# Altium schematic sheet Connectors.SchDoc
size Legal; SheetNumber: 5; SheetTotal: 5
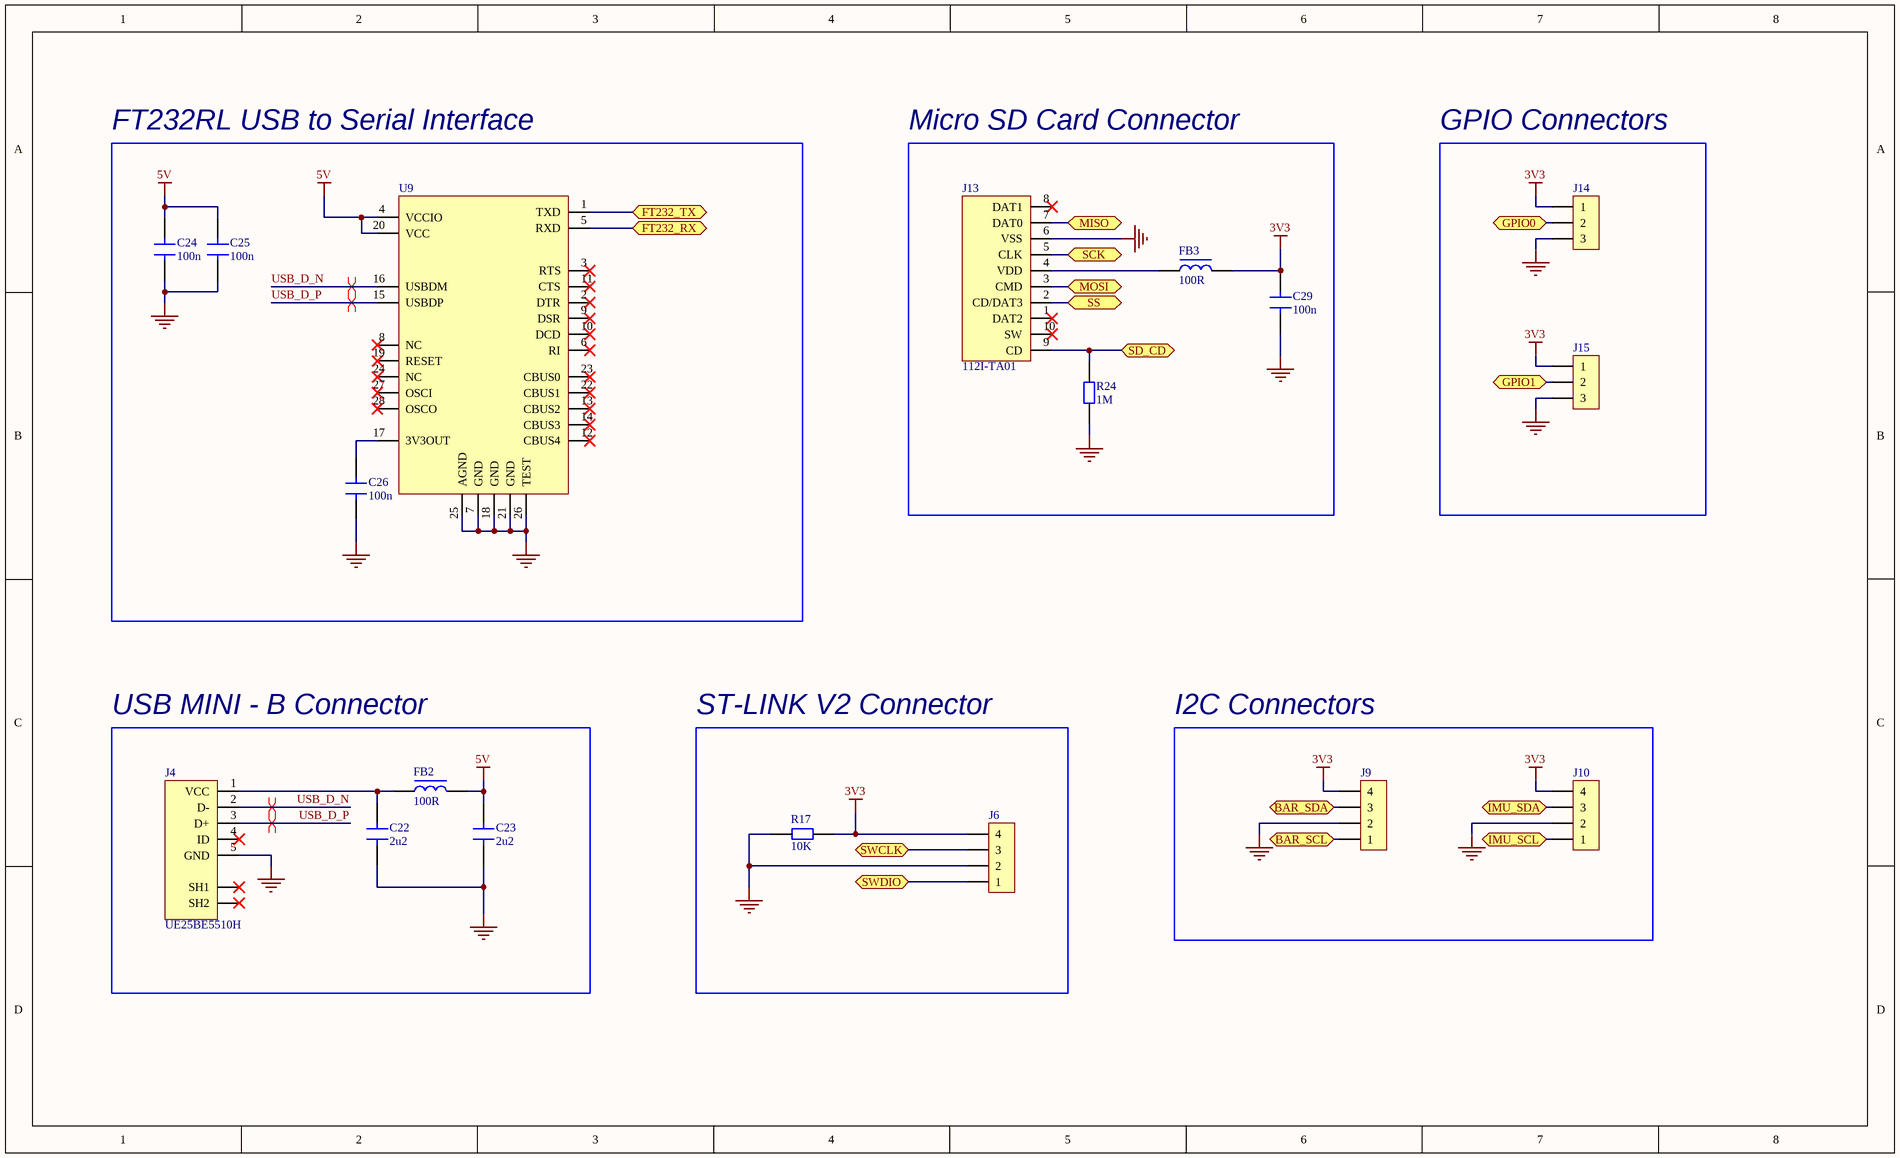
[diagram p0: Connectors.SchDoc]

## Parts
C22  2u2  [CAP 0805]
C23  2u2  [CAP 0805]
C24  100n  [CAP 0603]
C25  100n  [CAP 0603]
C26  100n  [CAP 0603]
C29  100n  [CAP 0603]
FB2  100R  [FB 0805]
FB3  100R  [FB 0603]
J4  UE25BE5510H  [UE25BE55H]
J6  1x4 HEADER MALE  [1X4 HEADER MALE]  (value not drawn)
J9  1x4 HEADER MALE  [1X4 HEADER MALE]  (value not drawn)
J10  1x4 HEADER MALE  [1X4 HEADER MALE]  (value not drawn)
J13  112I-TA01  [112I-TA01]
J14  JST B3B-XH-A  [JST_B3B-XH-A]  (value not drawn)
J15  JST B3B-XH-A  [JST_B3B-XH-A]  (value not drawn)
R17  10K  [RES 0603]
R24  1M  [RES 0603]
U9  FT232RL-REEL  [FT232RL]  (value not drawn)

## Blocks framed on the sheet
FT232RL USB to Serial Interface: C24-C26 U9
Micro SD Card Connector: C29 FB3 J13 R24
GPIO Connectors: J14 J15
USB MINI - B Connector: C22 C23 FB2 J4
ST-LINK V2 Connector: J6 R17
I2C Connectors: J9 J10

## Ports
BAR_SCL (bidir, see MCU[4C], Peripherals[3A]), BAR_SDA (bidir, see MCU[4C], Peripherals[3A]), FT232_RX (bidir, see MCU[4B]), FT232_TX (bidir, see MCU[4B]), GPIO0 (bidir, see MCU[4C]), GPIO1 (bidir, see MCU[4C]), IMU_SCL (bidir, see MCU[4B], Peripherals[5A]), IMU_SDA (bidir, see MCU[2C], Peripherals[5A]), MISO (bidir, see MCU[4B]), MOSI (bidir, see MCU[4B]), SCK (bidir, see MCU[4B]), SD_CD (bidir, see MCU[2C]), SS (bidir, see MCU[4B]), SWCLK (bidir, see MCU[4B]), SWDIO (bidir, see MCU[4B])

## Nets
3V3: C29.2 FB3.2 J6.4 J9.4 J10.4 J14.1 J15.1 R17.2
5V: C23.2 C24.2 C25.2 FB2.2 U9.4(VCCIO) U9.20(VCC)
GND: C22.1 C23.1 C24.1 C25.1 C26.1 C29.1 J4.5(GND) J6.2 J9.2 J10.2 J13.6(VSS) J14.3 J15.3 R17.1 R24.1 U9.7(GND) U9.18(GND) U9.21(GND) U9.25(AGND) U9.26(TEST)
BAR_SCL: J9.1 ; port BAR_SCL
BAR_SDA: J9.3 ; port BAR_SDA
FT232_RX: U9.5(RXD) ; port FT232_RX
FT232_TX: U9.1(TXD) ; port FT232_TX
GPIO0: J14.2 ; port GPIO0
GPIO1: J15.2 ; port GPIO1
IMU_SCL: J10.1 ; port IMU_SCL
IMU_SDA: J10.3 ; port IMU_SDA
MISO: J13.7(DAT0) ; port MISO
MOSI: J13.3(CMD) ; port MOSI
SCK: J13.5(CLK) ; port SCK
SD_CD: J13.9(CD) R24.2 ; port SD_CD
SS: J13.2(CD/DAT3) ; port SS
SWCLK: J6.3 ; port SWCLK
SWDIO: J6.1 ; port SWDIO
USB_D_N: J4.2(D-) U9.16(USBDM)
USB_D_P: J4.3(D+) U9.15(USBDP)
NetC22_2: C22.2 FB2.1 J4.1(VCC)
NetC26_2: C26.2 U9.17(3V3OUT)
NetFB3_1: FB3.1 J13.4(VDD)

Not connected (* = marked no-connect by the designer): J4 4(ID)* SH1* SH2*; J13 1(DAT2)* 8(DAT1)* 10(SW)*; U9 2(DTR)* 3(RTS)* 6(RI)* 8(NC)* 9(DSR)* 10(DCD)* 11(CTS)* 12(CBUS4)* 13(CBUS2)* 14(CBUS3)* 19(RESET)* 22(CBUS1)* 23(CBUS0)* 24(NC)* 27(OSCI)* 28(OSCO)*

## Layout directives
differential pair; differential pair class DIFF_USB: USB_D_N, USB_D_P

## Library data of the parts
C22 C23 = CAP 0805 25V: Capacitor SMD 0805 25V
C24-C26 C29 = CAP 0603 50V: Capacitor SMD 0603 50V
FB2 = FB 0805: Ferrite Bead SMD 0805
FB3 = FB 0603: Ferrite Bead SMD 0603
J4 = UE25BE5510H: Conn Mini USB 2.0 Type B RCP 5 POS 0.8mm Solder ST Thru-Hole 5 Terminal 1 Port; Manufacturer: Amphenol Commercial; Supplier 1: Arrow Electronics; Manufacturer Part Number: UE25BE5510H; RoHS: Yes; Category: USB Connectors; Stock 1: 16852; Pricing 1: 1=0,4693, 10=0,4507, 25=0,4468, 50=0,4303, 100=0,4157 (USD); ComponentLink1URL: http://www.alliedelec.com/m/d/e7e3d7a920045eebbdef787e60d8b001.pdf?src-supplier=Allied+Electronics; ComponentLink1Description: http://www.alliedelec.com/m/d/e7e3d7a920045eebbdef787e60d8b001.pdf?src-supplier=Allied+Electronics; ComponentLink2URL: https://www.amphenolcanada.com/ProductSearch/drawings/AC/UE25BEX510X.pdf?src-supplier=Digi-Key; ComponentLink2Description: https://www.amphenolcanada.com/ProductSearch/drawings/AC/UE25BEX510X.pdf?src-supplier=Digi-Key; ComponentLink3URL: https://datasheet.octopart.com/UE25-BE55-10H-Amphenol-datasheet-14681365.pdf?src-supplier=Future+Electronics; ComponentLink3Description: https://datasheet.octopart.com/UE25-BE55-10H-Amphenol-datasheet-14681365.pdf?src-supplier=Future+Electronics; ComponentLink4URL: https://datasheet.octopart.com/UE25BE5510H-Amphenol-Communications-Solutions-datasheet-62282189.pdf?src-supplier=Electro+Sonic; ComponentLink4Description: https://datasheet.octopart.com/UE25BE5510H-Amphenol-Communications-Solutions-datasheet-62282189.pdf?src-supplier=Electro+Sonic; Supplier Part Number 1: UE25BE5510H
J13 = 112I-TA01: Micro SD Card Push-Pull 10P (8+2), Switch, Peg, SMD 112I-TA01
J14 J15 = JST B3B-XH-A: Connector Header, XH Series, 3 Position, 2.50mm, Through Hole, Press-Fit, Solder, Natural; Manufacturer Part Number: B3B-XH-A(LF)(SN); Supplier 1: CoreStaff; Manufacturer: JST; RoHS: Yes; Category: Headers and Wire Housings; Stock 1: 2101; Pricing 1: 1=39,94, 10=25,1, 50=21,68, 100=18,25, 500=17,57, 1000=17,12, 2000=16,44, 4000=15,79 (JPY); ComponentLink1URL: https://datasheet.ciiva.com/26894/getdatasheetpartid-640434-26894454.pdf?src-supplier=Verical; ComponentLink1Description: https://datasheet.ciiva.com/26894/getdatasheetpartid-640434-26894454.pdf?src-supplier=Verical; ComponentLink2URL: https://datasheet.ciiva.com/26894/getdatasheetpartid-440399-26894778.pdf?src-supplier=Verical; ComponentLink2Description: https://datasheet.ciiva.com/26894/getdatasheetpartid-440399-26894778.pdf?src-supplier=Verical; ComponentLink3URL: https://datasheet.ciiva.com/11746/0900766b8082653f-11746520.pdf?src-supplier=Rs; ComponentLink3Description: https://datasheet.ciiva.com/11746/0900766b8082653f-11746520.pdf?src-supplier=Rs
R17 R24 = RES 0603: Resistor SMD 0603
U9 = FT232RL-REEL: IC USB FS SERIAL UART 28-SSOP; Manufacturer: FTDI; Interface: UART,RS-232,RS-422,RS-485; Data Rate: 12Mbps; Number of Channels: 1; Max Supply Voltage: 5.25V; Min Supply Voltage: 3.3V; Operating Supply Current: 15mA; Voltage: 5V; Supplier 1: Arrow Electronics; Manufacturer Part Number: FT232RL-REEL; RoHS: Yes; Category: Interface ICs; Stock 1: 3812; Pricing 1: 1=4,75, 10=4,3, 50=4,1 (USD); Mount: Surface Mount; Case/Package: SSOP; Number of Pins: 28; Weight: 0.080001oz; Min Operating Temperature: -40°C; Max Operating Temperature: 85°C; Packaging: Tape and Reel; Series: USBmadeEZ-UART; Package Quantity: 1; Number of Transceivers: 1; Length: 10.2mm; Width: 5.3mm; Height: 1.75mm; Radiation Hardening: No; Lead Free: Lead Free; RoHS Compliant: Yes; Reach SVHC Compliant: No; ComponentLink1URL: https://datasheet.ciiva.com/34304/2161019-34304054.pdf?src-supplier=Jameco; ComponentLink1Description: https://datasheet.ciiva.com/34304/2161019-34304054.pdf?src-supplier=Jameco; ComponentLink2URL: https://datasheet.ciiva.com/4787/ds-ft232r-11534-4787658.pdf?src-supplier=Mouser; ComponentLink2Description: https://datasheet.ciiva.com/4787/ds-ft232r-11534-4787658.pdf?src-supplier=Mouser; ComponentLink3URL: https://datasheet.ciiva.com/1787/ds-ft232r-1787048.pdf?src-supplier=Digikey; ComponentLink3Description: https://datasheet.ciiva.com/1787/ds-ft232r-1787048.pdf?src-supplier=Digikey; ComponentLink4URL: https://datasheet.ciiva.com/1787/ds-ft232r-1787047.pdf?src-supplier=Digikey; ComponentLink4Description: https://datasheet.ciiva.com/1787/ds-ft232r-1787047.pdf?src-supplier=Digikey; ComponentLink5URL: https://datasheet.ciiva.com/1787/ds-ft232r-1787049.pdf?src-supplier=Digikey; ComponentLink5Description: https://datasheet.ciiva.com/1787/ds-ft232r-1787049.pdf?src-supplier=Digikey; ComponentLink6URL: https://datasheet.ciiva.com/16200/ds-ft232r-16200652.pdf?src-supplier=Future+Electronics; ComponentLink6Description: https://datasheet.ciiva.com/16200/ds-ft232r-16200652.pdf?src-supplier=Future+Electronics; ComponentLink7URL: https://datasheet.ciiva.com/15150/getdatasheetpartid-643207-15150506.pdf?src-supplier=Verical; ComponentLink7Description: https://datasheet.ciiva.com/15150/getdatasheetpartid-643207-15150506.pdf?src-supplier=Verical